# Altium schematic sheet Sheet1.SchDoc
size A; SheetNumber: 2; SheetTotal: 2
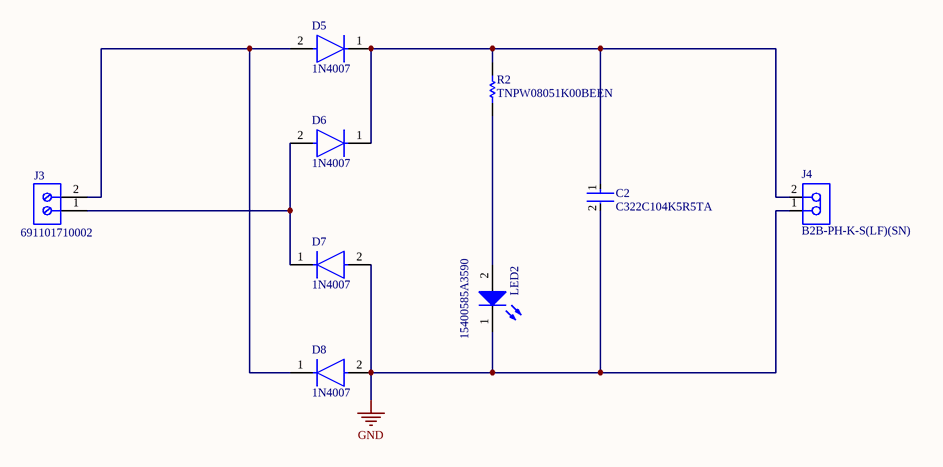
[diagram p0: Sheet1.SchDoc]

## Parts
C2  C322C104K5R5TA  [FP-C322C104K5R5TA-MFG]
D5  1N4007  [FP-1N4007-MFG]
D6  1N4007  [FP-1N4007-MFG]
D7  1N4007  [FP-1N4007-MFG]
D8  1N4007  [FP-1N4007-MFG]
J3  691101710002  [691101710002]
J4  B2B-PH-K-S(LF)(SN)  [JST-B2B-PH-K-S_V]
LED2  15400585A3590  [WL-TIRW_D5.8H8.6]
R2  TNPW08051K00BEEN  [RESC2013X55X40LL15T20]

## Nets
GND: C2.2 D7.2(A) D8.2(A) J4.1 LED2.1(K)
NetC2_1: C2.1 D5.1(C) D6.1(C) J4.2 R2.2
NetD5_2: D5.2(A) D8.1(C) J3.2
NetD6_2: D6.2(A) D7.1(C) J3.1
NetLED2_2: LED2.2(A) R2.1

## Library data of the parts
C2 = CMP-03020-034661-1: CAP CER 0.1UF 50V X7R RADIAL; Capacitance: 100nF; Dielectric Material: Ceramic; Dissipation Factor: 2.5%; Lead Length: 7mm; Tolerance: 10%; Lead Diameter: 0.51mm; Lead/Base Style: Formed Leads; Construction: RADIAL; RoHS Compliant: Yes; Voltage Rating (DC): 50V; Packaging: Bulk; Lead Free: Lead Free; Width: 0.125inch; Lead Pitch: 5.08mm; Voltage Rating: 50V; Number of Pins: 2; Radiation Hardening: No; Material: Ceramic; REACH SVHC: No SVHC; Height - Seated (Max): 0.26inch; Case/Package: Radial; Weight: 0.0625lb; Dielectric: X7R; Min Operating Temperature: -55°C; Voltage: 50V; Series: Golden Max™; Max Operating Temperature: 125°C; Height: 3.18mm; Termination: Radial; Length: 5.08mm; Depth: 3.18mm; Package Quantity: 500; Mount: Through Hole
D5-D8 = CMP-123542-000001-1: Rectifier diode 1000 V 1 A DO-41, ,; Manufacturer: Diotec; Max Surge Forward Current: 27A; Forward Current: 1A; Max Junction Temp: +175°C; Reverse Voltage: 1000V; Value: 15pF; Peak Reverse Current: 5uA; Category: Diode; Temperature Range Low: -50°C; Automotive: No; Temperature: -50°C to +175°C; Lead Free: Yes; ComponentLink2Description: Datasheet; Max Repetitive Reverse Voltage: 1000V; ComponentLink2URL: https://datasheet.octopart.com/1N4007-Diotec-datasheet-62346875.pdf; Manufacturer Part Number: 1N4007; Device Class L3: Rectifier Diodes; Height: 2.8mm; Octopart: https://octopart.com/1n4007-diotec-4040411; Package: 1N4007; Temperature Range High: +175°C; Device Class L1: Discrete Semiconductors; Device Class L2: Diodes; RoHS: TRUE; Capacitance: 15pF; Ipc Land Pattern Name: DIOAD888W100L520D280
J3 = CMP-1502-03256-3: Conn Terminal Block 2 POS 5mm Solder ST Thru-Hole 16A Box; Voltage Rating: 250V; Plating: Steel; Wire/Cable Gauge: 26AWG; Number of Contacts: 2; Wire Gauge (Min): 14AWG; Stripping Length: -7mm; Pitch: 5.0038mm; Number of Levels: 1; Width: 11.2mm; Color: Blue; Contact Plating: Tin; Number of Rows: 1; Voltage: 250V; Termination: Screw; Current: 16A; Lead Pitch: 5mm; RoHS: Compliant; Height: 12.8mm; Number of Positions Per Level: 2; Wire Gauge (Max): 26AWG; Contact Material: Brass; Number of Pins: 2; Housing Material: Nylon; Max Operating Temperature: 105°C; Min Operating Temperature: -40°C; Packaging: Box; Current Rating: 16A; Length: 9mm; Mount: Through Hole
J4 = CMP-2000-05162-1: Male Header, Pitch 2 mm, 1 x 2 Position, Height 6 mm, Tail Length 3.4 mm, -25 to 85 degC, RoHS, Bulk; Manufacturer: JST; Pitch: 2mm; Style/Orientation: StraightHeader/Plug; No of Positions: 2; Datasheet Version: Nov-08; Datasheet URL: http://datasheet.octopart.com/B2B-PH-K-S%28LF%29%28SN%29-JST-datasheet-8324864.pdf; Manufacturer URL: http://www.jst.com/home2.html; Type: ShroudedHeader; Termination: Crimp
LED2 = CMP-03913-82270985-2: WL-TIRW THT Infrared Round Waterclear; Viewing Angle: 35°; Peak Wavelength: 850nm; Forward Current: 1A; Max Reverse Voltage (DC): 5V; Forward Voltage: 1.5V; Wavelength: 850nm; RoHS: Compliant; Packaging: Bulk
R2 = CMP-2001-04738-1: Manufacturer: Vishay Dale; Part Number: TNPW08051K00BEEN